# EAGLE schematic PCA9635_Breadboard (EAGLE 6.1)
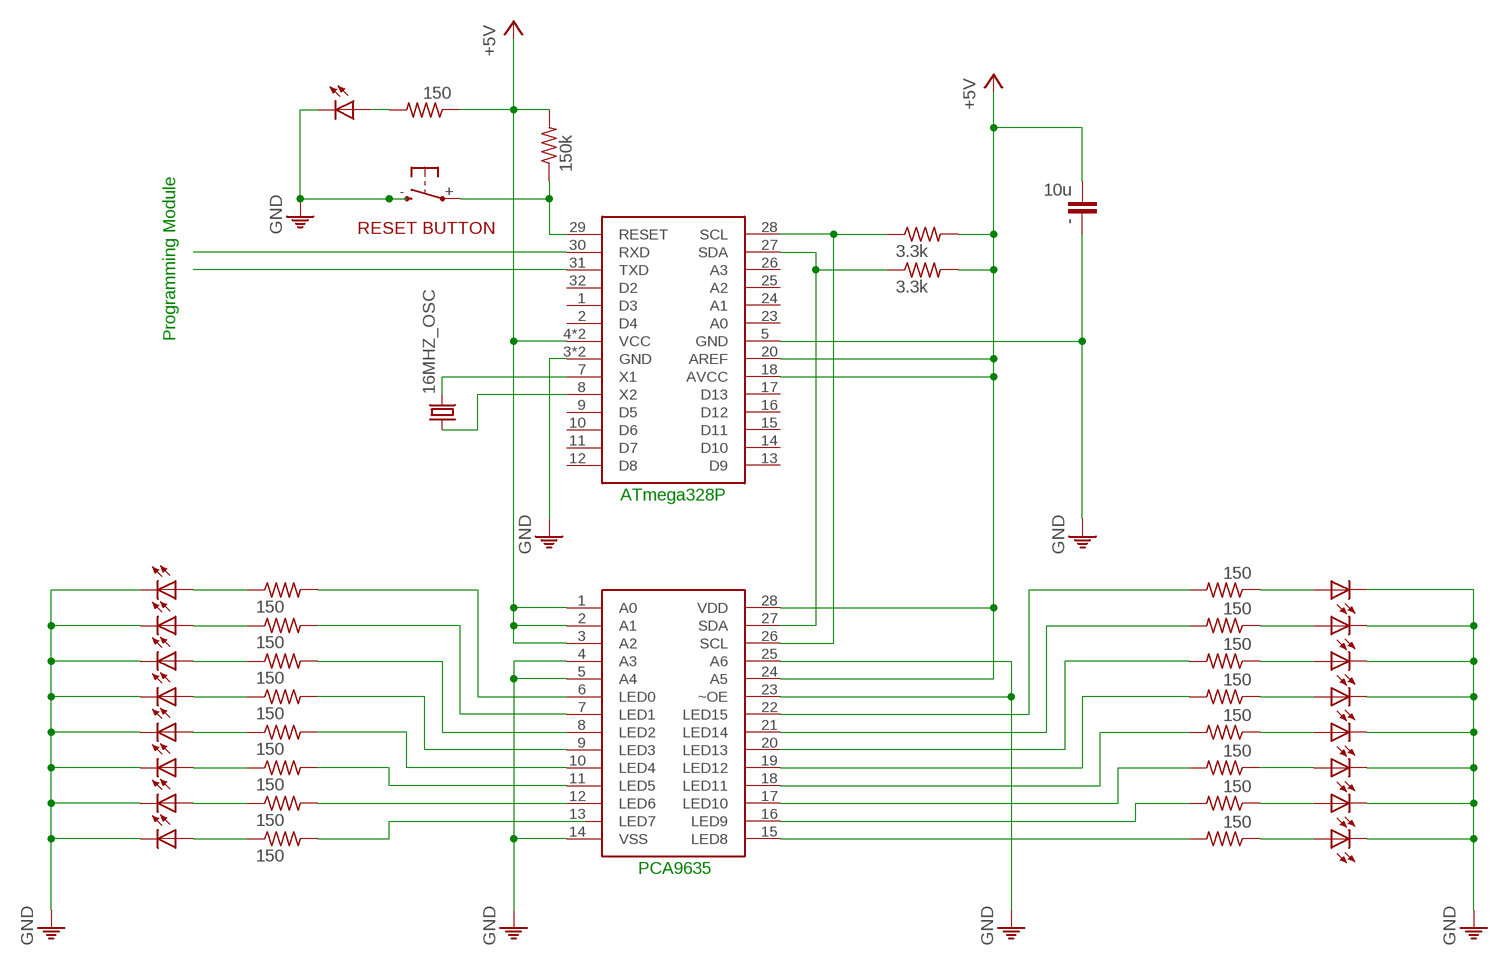
[diagram p0: schematic, sheet 1]

## Parts
16MHZ_OSC  CRYSTAL5X3  [CRYSTAL-SMD-5X3]
'  10u  CXXC10B6  [XC10B6]
U$1  PCA9635  [TSSOP28]
U$2  ATMEGA328P  [TQFP32-08]
U$3  LED2  [LUMILED]
U$4  LED2  [LUMILED]
U$5  LED2  [LUMILED]
U$6  LED2  [LUMILED]
U$7  LED2  [LUMILED]
U$8  LED2  [LUMILED]
U$9  LED2  [LUMILED]
U$10  150  R-US2  [0204/5]
U$11  LED2  [LUMILED]
U$12  150  R-US2  [0204/5]
U$13  150  R-US2  [0204/5]
U$14  150  R-US2  [0204/5]
U$15  150  R-US2  [0204/5]
U$16  150  R-US2  [0204/5]
U$17  150  R-US2  [0204/5]
U$18  150  R-US2  [0204/5]
U$19  LED2  [LUMILED]
U$20  LED2  [LUMILED]
U$21  LED2  [LUMILED]
U$22  LED2  [LUMILED]
U$23  LED2  [LUMILED]
U$24  LED2  [LUMILED]
U$25  LED2  [LUMILED]
U$26  LED2  [LUMILED]
U$27  150  R-US2  [0204/5]
U$28  150  R-US2  [0204/5]
U$29  150  R-US2  [0204/5]
U$30  150  R-US2  [0204/5]
U$31  150  R-US2  [0204/5]
U$32  150  R-US2  [0204/5]
U$33  150  R-US2  [0204/5]
U$34  150  R-US2  [0204/5]
U$35  RESET_BUTTON  [DUMMYRESET]
U$36  150k  R-US2  [0204/5]
U$38  3.3k  R-US2  [0204/5]
U$40  3.3k  R-US2  [0204/5]
U$41  LED2  [LUMILED]
U$43  150  R-US2  [0204/5]

## Nets
+5V: '.2 U$1.1(A0) U$1.2(A1) U$1.3(A2) U$1.24(A5) U$1.28(VDD) U$2.4(VCC) U$2.6(VCC) U$2.18(AVCC) U$2.20(AREF) U$36.2 U$38.2 U$40.2 U$43.1
N$1: U$1.6(LED0) U$10.2
N$2: U$1.7(LED1) U$12.2
N$3: U$1.8(LED2) U$13.2
N$4: U$1.9(LED3) U$14.2
N$5: U$1.10(LED4) U$15.2
N$6: U$1.11(LED5) U$16.2
N$7: U$1.12(LED6) U$17.2
N$8: U$18.2
N$9: U$1.22(LED15) U$34.2
N$10: U$1.21(LED14) U$33.2
N$11: U$1.20(LED13) U$32.2
N$12: U$1.19(LED12) U$31.2
N$13: U$1.18(LED11) U$30.2
N$14: U$1.17(LED10) U$29.2
N$15: U$1.16(LED9) U$28.2
N$16: U$1.15(LED8) U$27.2
N$17: U$26.1NC(A) U$26.3NC(A) U$34.1
N$18: U$25.1NC(A) U$25.3NC(A) U$33.1
N$19: U$24.1NC(A) U$24.3NC(A) U$32.1
N$20: U$23.1NC(A) U$23.3NC(A) U$31.1
N$21: U$22.1NC(A) U$22.3NC(A) U$30.1
N$22: U$21.1NC(A) U$21.3NC(A) U$29.1
N$23: U$20.1NC(A) U$20.3NC(A) U$28.1
N$24: U$19.1NC(A) U$19.3NC(A) U$27.1
N$25: U$11.1NC(A) U$11.3NC(A) U$18.1
N$26: U$9.1NC(A) U$9.3NC(A) U$17.1
N$27: U$8.1NC(A) U$8.3NC(A) U$16.1
N$28: U$7.1NC(A) U$7.3NC(A) U$15.1
N$29: U$6.1NC(A) U$6.3NC(A) U$14.1
N$30: U$5.1NC(A) U$5.3NC(A) U$13.1
N$31: U$4.1NC(A) U$4.3NC(A) U$12.1
N$32: U$3.1NC(A) U$3.3NC(A) U$10.1
N$33: U$1.27(SDA) U$2.27(SDA) U$38.1
N$34: U$1.26(SCL) U$2.28(SCL) U$40.1
N$35: U$2.30(RXD)
N$36: U$2.31(TXD)
N$37: U$2.29(RESET) U$35.+ U$36.1
N$38: U$41.1NC(A) U$41.3NC(A) U$43.2
N$39: 16MHZ_OSC.3 U$2.7(X1)
N$40: 16MHZ_OSC.1 U$2.8(X2)
PE: '.1 U$1.4(A3) U$1.5(A4) U$1.14(VSS) U$1.23(~OE) U$1.25(A6) U$2.3(GND) U$2.5(GND) U$2.21(GND) U$3.2+(C) U$3.4-(C) U$4.2+(C) U$4.4-(C) U$5.2+(C) U$5.4-(C) U$6.2+(C) U$6.4-(C) U$7.2+(C) U$7.4-(C) U$8.2+(C) U$8.4-(C) U$9.2+(C) U$9.4-(C) U$11.2+(C) U$11.4-(C) U$19.2+(C) U$19.4-(C) U$20.2+(C) U$20.4-(C) U$21.2+(C) U$21.4-(C) U$22.2+(C) U$22.4-(C) U$23.2+(C) U$23.4-(C) U$24.2+(C) U$24.4-(C) U$25.2+(C) U$25.4-(C) U$26.2+(C) U$26.4-(C) U$35.- U$41.2+(C) U$41.4-(C) ; supply symbol labelled GND
Unconnected: U$1.13(LED7) U$2.1(D3) U$2.2(D4) U$2.9(D5) U$2.10(D6) U$2.11(D7) U$2.12(D8) U$2.13(D9) U$2.14(D10) U$2.15(D11) U$2.16(D12) U$2.17(D13) U$2.23(A0) U$2.24(A1) U$2.25(A2) U$2.26(A3) U$2.32(D2)

## Notes on the sheet
- Programming Module
- ATmega328P
- PCA9635

## Library data of the parts
16MHZ_OSC = SparkFun-FreqCtrl:CRYSTAL: Various standard crystals. Proven footprints. Spark Fun Electronics SKU : COM-00534
' = rcl:CX: X CAPACITOR for power line
U$1 = nxp semiconductors:PCA9635: TSSOP28 package copied from "analog devices" library. Check dimensions
U$2 = atmel:ATMEGA328P
U$3-U$9 U$11 U$19-U$26 U$41 = led-lumiled:LED2
U$10 U$12-U$18 U$27-U$34 U$36 U$38 U$40 U$43 = rcl:R-US2
U$35 = lightsuits:RESET_BUTTON